# Altium schematic sheet Screen.SchDoc: Screen
size A4; SheetNumber: 10
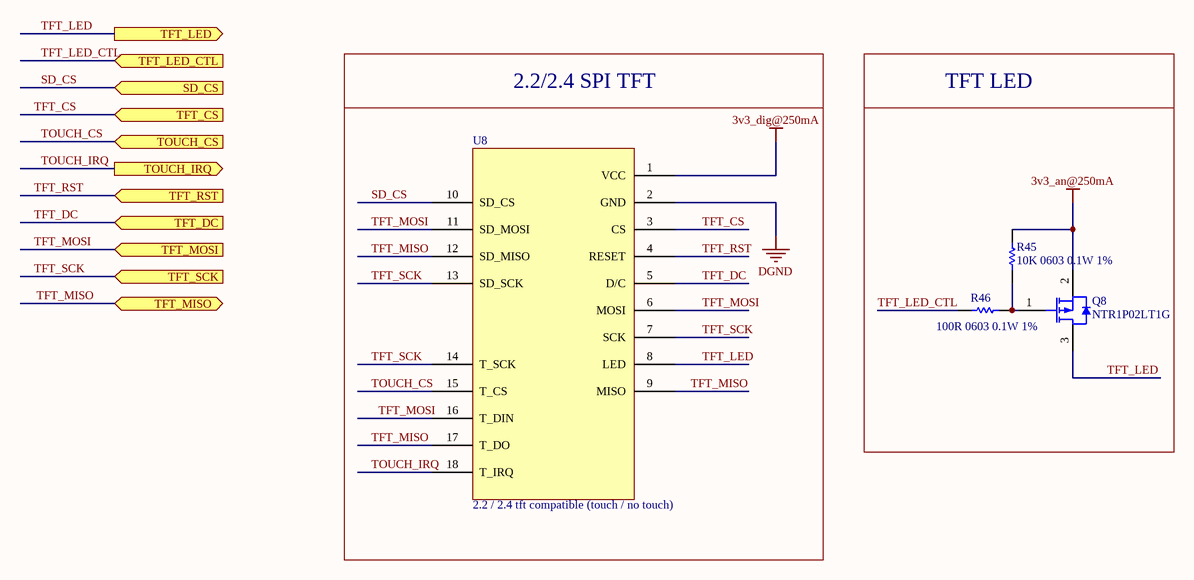
[diagram p0: Screen.SchDoc]

## Parts
Q8  NTR1P02LT1G  [ONSC-SOT-23-3-318-08_V]
R45  10K 0603 0.1W 1%  [RESC1609X55X30ML10T20]
R46  100R 0603 0.1W 1%  [RESC1609X55X30ML10T20]
U8  2.2 / 2.4 tft compatible (touch / no touch)  [PCB-0iq7iyy8nrzrpmpo9lhg-1]

## Blocks framed on the sheet
2.2/2.4 SPI TFT: U8
TFT LED: Q8 R45 R46

## Ports
SD_CS (in), TFT_CS (in), TFT_DC (in), TFT_LED (out), TFT_LED_CTL (in), TFT_MISO, TFT_MOSI (in), TFT_RST (in), TFT_SCK (in), TOUCH_CS (in), TOUCH_IRQ (out)

## Nets
3v3_an@250mA: Q8.2(S) R45.1
3v3_dig@250mA: U8.1(VCC)
DGND: U8.2(GND)
SD_CS: U8.10(SD_CS) ; port SD_CS
TFT_CS: U8.3(CS) ; port TFT_CS
TFT_DC: U8.5(D/C) ; port TFT_DC
TFT_LED: Q8.3(D) U8.8(LED) ; port TFT_LED
TFT_LED_CTL: R46.2 ; port TFT_LED_CTL
TFT_MISO: U8.9(MISO) U8.12(SD_MISO) U8.17(T_DO) ; port TFT_MISO
TFT_MOSI: U8.6(MOSI) U8.11(SD_MOSI) U8.16(T_DIN) ; port TFT_MOSI
TFT_RST: U8.4(RESET) ; port TFT_RST
TFT_SCK: U8.7(SCK) U8.13(SD_SCK) U8.14(T_SCK) ; port TFT_SCK
TOUCH_CS: U8.15(T_CS) ; port TOUCH_CS
TOUCH_IRQ: U8.18(T_IRQ) ; port TOUCH_IRQ
NetQ8_1: Q8.1(G) R45.2 R46.1

## Notes on the sheet
- Title
- Size:
- Date:
- A3
- Author:
- Time:
- Revision:
- Sheet
- of
- File:

## Library data of the parts
Q8 = CMP-836800-2: Power MOSFET, -20 V, -1.3 A, P-Channel, 3-Pin SOT-23, Pb-Free, Tape and Reel; Current Rating: -1.3 A; Drain to Source Resistance (on) (Rds): 0.22 Ω; Drain to Source Voltage (Vds): -20.0 V; Lead-Free Status: Lead Free; Power Dissipation: 0.4 W; Rise Time: 1.5e-08 s; Manufacturer Part Number: NTR1P02LT1G; Case/Package: SOT-23; Lifecycle Status: Active; Mounting Style: Surface Mount; Octopart Url: https://octopart.com/ntr1p02lt1g-on+semiconductor-341571; OctopartID: 11ecd8e302c9ce2b; Packaging: Tape; Polarity: P-Channel; RoHS: Compliant; Voltage Rating (DC): -20.0 V
R45 = CMP-4716590-9: Manufacturer Part Number: ERJ-3GEYJ101V; Octopart Url: https://octopart.com/crcw060310k0fkeahp-vishay-42634028; package: 0603; Resistance: 10k; Tolerance: 1%
R46 = CMP-a61f6f36030f79d8-4: Manufacturer Part Number: ERJ3GEYJ101V; Power Rating: 100 mW; Resistance: 1k; Case/Package (SI): 1608; Voltage Rating (DC): 50.0 V; Temperature Coefficient: -100 ppm/°C to 100 ppm/°C; REACH SVHC Compliance: No SVHC; Packaging: Tape & Reel (TR), Cut Tape (CT); Resistance Tolerance: ±1%; RoHS: Compliant; Mounting Style: Surface Mount; Number of Pins: 2; Size-Length: 1.60 mm; Octopart URL: https://octopart.com/cr0603-fx-1001elf-bourns-2326646; Size-Thickness: 457 µm; OctopartID: a61f6f36030f79d8; Size-Width: 787 µm; Case/Package: 0603
U8 = CMP-m0xp0jkbbaqlzhag27re-16: TZT 2.4" 240x320 SPI TFT LCD Serial Port Module+5V/3.3V PBC Adapter Micro SD ILI9341; CustomComponentID: m0xp0jkbbaqlzhag27re